# EAGLE schematic 473 (EAGLE 7.2.0)
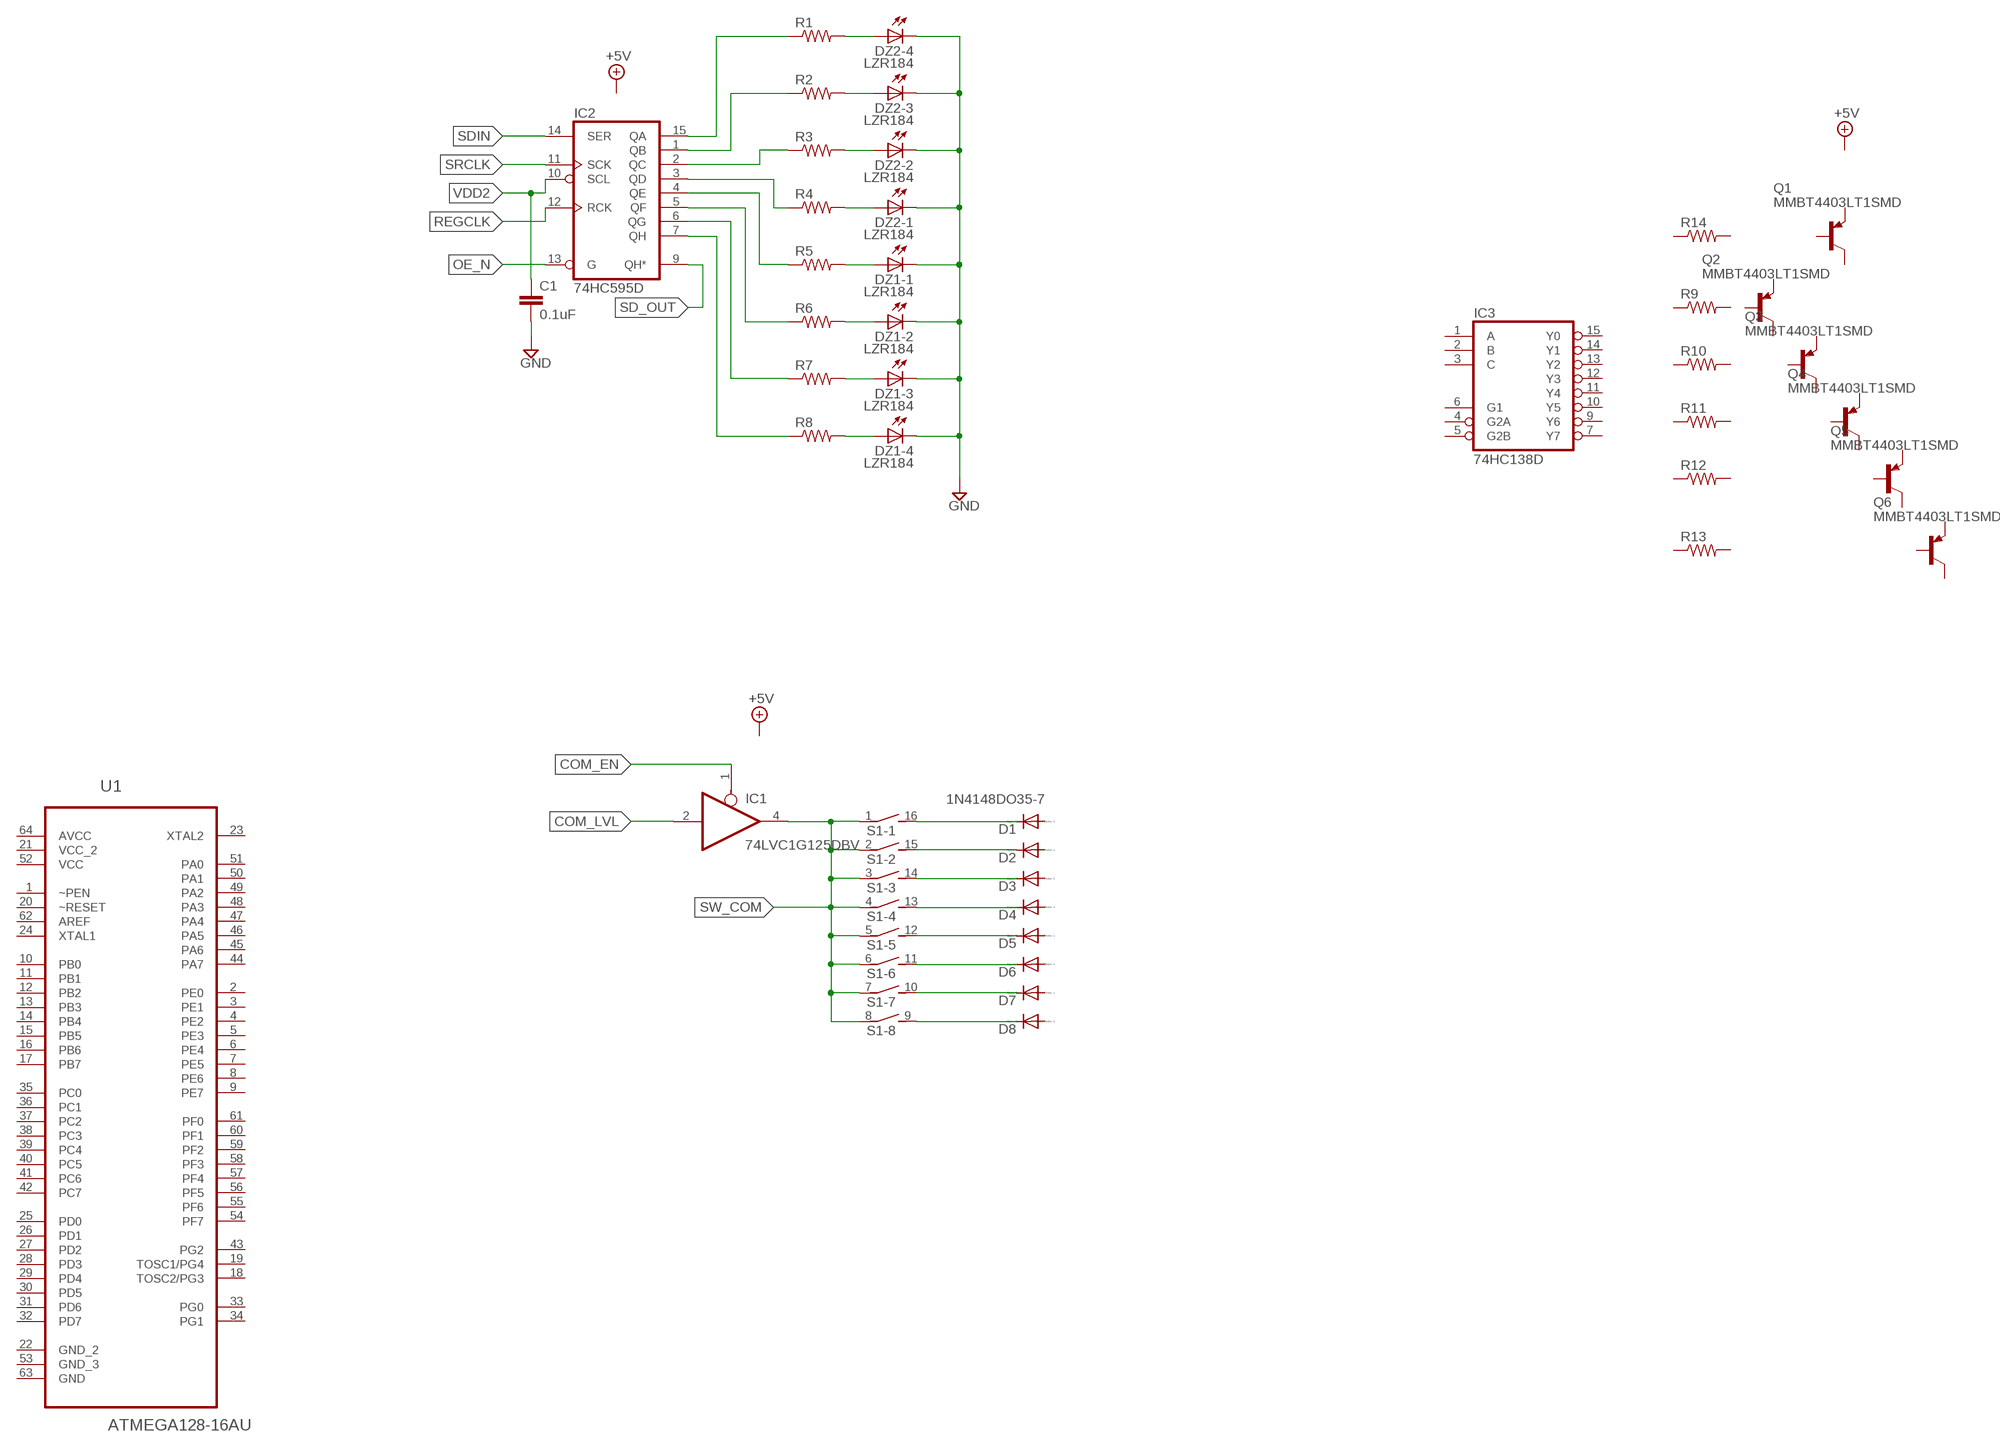
[diagram p0: schematic, sheet 1]

## Parts
C1  0.1uF  C-EUC0805  [C0805]
D1  1N4148DO35-7  [DO35-7]
D2  1N4148DO35-7  [DO35-7]
D3  1N4148DO35-7  [DO35-7]
D4  1N4148DO35-7  [DO35-7]
D5  1N4148DO35-7  [DO35-7]
D6  1N4148DO35-7  [DO35-7]
D7  1N4148DO35-7  [DO35-7]
D8  1N4148DO35-7  [DO35-7]
DZ1  LZR184  [LZR184]
DZ2  LZR184  [LZR184]
IC1  74LVC1G125DBV  [SOT23-5]
IC2  74HC595D  [SO16]
IC3  74HC138D  [SO16]
Q1  MMBT4403LT1SMD  [SOT23-BEC]
Q2  MMBT4403LT1SMD  [SOT23-BEC]
Q3  MMBT4403LT1SMD  [SOT23-BEC]
Q4  MMBT4403LT1SMD  [SOT23-BEC]
Q5  MMBT4403LT1SMD  [SOT23-BEC]
Q6  MMBT4403LT1SMD  [SOT23-BEC]
R1  R-US_R0603  [R0603]
R2  R-US_R0603  [R0603]
R3  R-US_R0603  [R0603]
R4  R-US_R0603  [R0603]
R5  R-US_R0603  [R0603]
R6  R-US_R0603  [R0603]
R7  R-US_R0603  [R0603]
R8  R-US_R0603  [R0603]
R9  R-US_R0603  [R0603]
R10  R-US_R0603  [R0603]
R11  R-US_R0603  [R0603]
R12  R-US_R0603  [R0603]
R13  R-US_R0603  [R0603]
R14  R-US_R0603  [R0603]
S1  DIP08SB  [DIP08SB]
U1  ATMEGA128-16AU  [QFP80P1600X1600X120-64N]

## Nets
COM_EN: IC1.1(OE)
COM_LVL: IC1.2(I)
GND: C1.2 DZ1.K1(-1:C) DZ1.K2(-2:C) DZ1.K3(-3:C) DZ1.K4(-4:C) DZ2.K1(-1:C) DZ2.K2(-2:C) DZ2.K3(-3:C) DZ2.K4(-4:C)
N$1: D1.C S1.16
N$2: D2.C S1.15
N$3: D3.C S1.14
N$4: D4.C S1.13
N$5: D5.C S1.12
N$6: D6.C S1.11
N$7: D7.C S1.10
N$8: D8.C S1.9
N$10: IC2.7(QH) R8.1
N$11: IC2.6(QG) R7.1
N$12: IC2.5(QF) R6.1
N$13: IC2.4(QE) R5.1
N$14: IC2.3(QD) R4.1
N$15: IC2.15(QA) R1.1
N$16: IC2.1(QB) R2.1
N$17: IC2.2(QC) R3.1
N$18: DZ2.A4(-4:A) R1.2
N$19: DZ2.A3(-3:A) R2.2
N$20: DZ2.A2(-2:A) R3.2
N$21: DZ2.A1(-1:A) R4.2
N$22: DZ1.A1(-1:A) R5.2
N$23: DZ1.A2(-2:A) R6.2
N$24: DZ1.A3(-3:A) R7.2
N$25: DZ1.A4(-4:A) R8.2
OE_N: IC2.13(G)
REGCLK: IC2.12(RCK)
SD_OUT: IC2.9(QH*)
SDIN: IC2.14(SER)
SRCLK: IC2.11(SCK)
SW_COM: IC1.4(O) S1.1 S1.2 S1.3 S1.4 S1.5 S1.6 S1.7 S1.8
VDD2: C1.1 IC2.10(SCL)
Unconnected: D1.A D2.A D3.A D4.A D5.A D6.A D7.A D8.A IC3.1(A) IC3.2(B) IC3.3(C) IC3.4(G2A) IC3.5(G2B) IC3.6(G1) IC3.7(Y7) IC3.9(Y6) IC3.10(Y5) IC3.11(Y4) IC3.12(Y3) IC3.13(Y2) IC3.14(Y1) IC3.15(Y0) Q1.B Q1.C Q1.E Q2.B Q2.C Q2.E Q3.B Q3.C Q3.E Q4.B Q4.C Q4.E Q5.B Q5.C Q5.E Q6.B Q6.C Q6.E R9.1 R9.2 R10.1 R10.2 R11.1 R11.2 R12.1 R12.2 R13.1 R13.2 R14.1 R14.2 U1.1(~PEN) U1.2(PE0) U1.3(PE1) U1.4(PE2) U1.5(PE3) U1.6(PE4) U1.7(PE5) U1.8(PE6) U1.9(PE7) U1.10(PB0) U1.11(PB1) U1.12(PB2) U1.13(PB3) U1.14(PB4) U1.15(PB5) U1.16(PB6) U1.17(PB7) U1.18(TOSC2/PG3) U1.19(TOSC1/PG4) U1.20(~RESET) U1.22(GND_2) U1.23(XTAL2) U1.24(XTAL1) U1.25(PD0) U1.26(PD1) U1.27(PD2) U1.28(PD3) U1.29(PD4) U1.30(PD5) U1.31(PD6) U1.32(PD7) U1.33(PG0) U1.34(PG1) U1.35(PC0) U1.36(PC1) U1.37(PC2) U1.38(PC3) U1.39(PC4) U1.40(PC5) U1.41(PC6) U1.42(PC7) U1.43(PG2) U1.44(PA7) U1.45(PA6) U1.46(PA5) U1.47(PA4) U1.48(PA3) U1.49(PA2) U1.50(PA1) U1.51(PA0) U1.53(GND_3) U1.54(PF7) U1.55(PF6) U1.56(PF5) U1.57(PF4) U1.58(PF3) U1.59(PF2) U1.60(PF1) U1.61(PF0) U1.62(AREF) U1.63(GND)

## Power pins joined to a net without a drawn wire
AVCC: U1.64(AVCC)
GND: IC1.3(GND) IC2.8(GND) IC3.8(GND)
VCC: IC1.5(VCC) IC2.16(VCC) IC3.16(VCC) U1.52(VCC)
VCC_2: U1.21(VCC_2)

## Library data of the parts
C1 = resistor:C-EU: CAPACITOR, European symbol
D1-D8 = diode:1N4148: DIODE high speed (Philips)
DZ1 DZ2 = led:LZR184: LED BLOCK 4 LEDs, Siemens
IC1 = 74xx-little-us:74*1G125: Single Bus Buffer Gate with 3-State Output
IC2 = 74xx-eu:74*595: 8-bit SHIFT REGISTER, output latch
IC3 = 74xx-eu:74*138: 3-line to 8-line DECODER/DEMULTIPLEXER
Q1-Q6 = transistor-pnp:MMBT4403*: PNP Transistror
R1-R14 = resistor:R-US_: RESISTOR, American symbol
S1 = switch-dil:DIP08SB: DIL/CODE SWITCH; OC_FARNELL: unknown; OC_NEWARK: unknown
U1 = Atmel_By_element14_Batch_1-00:ATMEGA128-16AU: MCU; DESCRIPTION: MCU; MPN: ATMEGA128-16AU; OC_FARNELL: 9171118; OC_NEWARK: 95K7364; PACKAGE: QFP-64; SUPPLIER: Atmel